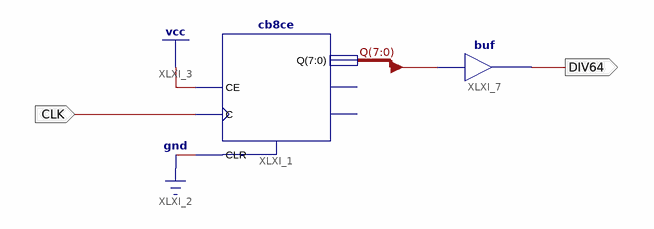
[diagram p0: schematic sheet 1]
// Xilinx ISE schematic ClockDiv64.sch (xc9500xl) as structural Verilog: 2 symbols, 2 ports
module ClockDiv64 (
  input  CLK,
  output DIV64
);

  wire [7:0] Q;

  cb8ce XLXI_1 (.C(CLK), .CE(1'b1), .CLR(1'b0), .Q(Q));  // open: CEO, TC
  buf XLXI_7 (DIV64, Q[6]);
endmodule
